# Altium schematic sheet RF_Power_small_doubler.SchDoc
size A
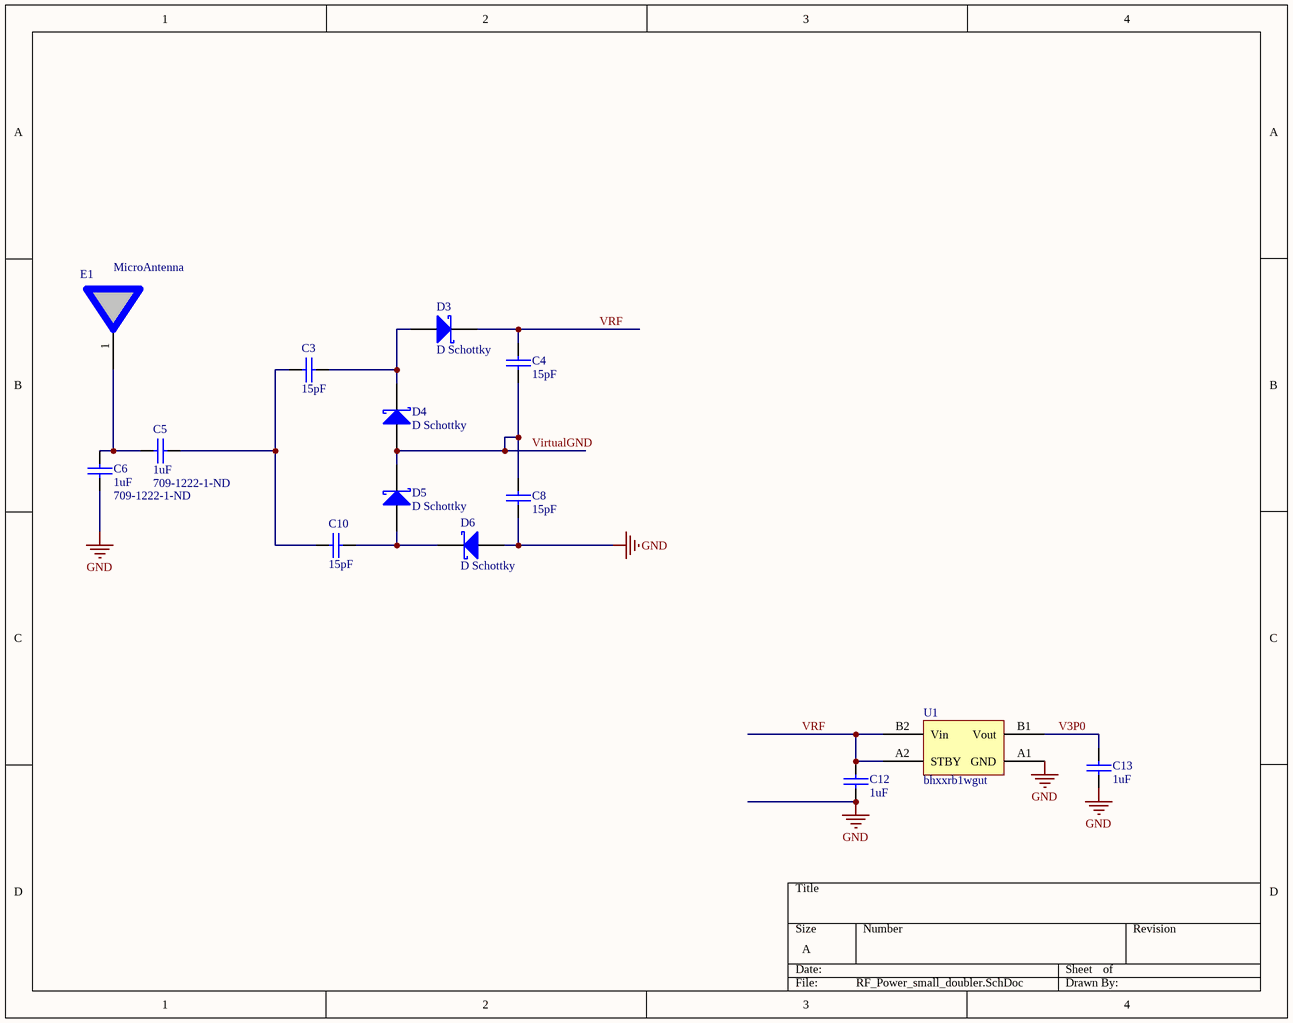
[diagram p0: RF_Power_small_doubler.SchDoc]

## Parts
C3  value 15pF  [0201]  (hidden comment: NP0 50V)
C4  value 15pF  [0201]  (hidden comment: NP0 50V)
C5  value 1uF  Supplier Part Number 1: 709-1222-1-ND  [0402]  (hidden comment: NP0 50V)
C6  value 1uF  Supplier Part Number 1: 709-1222-1-ND  [0402]  (hidden comment: NP0 50V)
C8  value 15pF  [0201]  (hidden comment: NP0 50V)
C10  value 15pF  [0201]  (hidden comment: NP0 50V)
C12  value 1uF  [CAPC1005L]  (hidden comment: NP0 50V)
C13  value 1uF  [CAPC1005L]  (hidden comment: NP0 50V)
D3  D Schottky  [Diode0201]
D4  D Schottky  [Diode0201]
D5  D Schottky  [Diode0201]
D6  D Schottky  [Diode0201]
E1  MicroAntenna  [2450AT18B100]
U1  bhxxrb1wgut  [BGA2x2_p5]

## Nets
GND: C6.2 C8.2 C12.2 C13.1 D6.1(A) U1.A1(GND)
V3P0: C13.2 U1.B1(Vout)
VirtualGND: C4.2 C8.1 D4.1(A) D5.2(K)
VRF: C4.1 C12.1 D3.2(K) U1.A2(STBY) U1.B2(Vin)
NetC3_1: C3.1 D3.1(A) D4.2(K)
NetC3_2: C3.2 C5.1 C10.2
NetC5_2: C5.2 C6.1 E1.1
NetC10_1: C10.1 D5.1(A) D6.2(K)

Not connected (* = marked no-connect by the designer): E1 2

## Library data of the parts
C3 C4 C8 C10 = Cap: Capacitor; Part Field 1: 0201
C5 C6 = Cap: Capacitor; Manufacturer: Johanson Dielectrics Inc; Manufacturer Part Number: 100R07X105KV4T; Description: CAP CER 1UF 10V X5R 0402; Capacitance: 1.0µF; Voltage - Rated: 10V; Tolerance: ±10%; Temperature Coefficient: X5R; Part Field 1: 0402; Supplier 1: Digi-Key; RoHS: RoHS Compliant; Category: Capacitors; Stock 1: 22620; Pricing 1: 10=0.146, 100=0.0861, 500=0.04968, 1000=0.03445 (USD); Mounting Type: Surface Mount, MLCC; Operating Temperature: -55°C ~ 85°C; Applications: SMPS Filtering; Ratings: -; Package / Case: 0402 (1005 Metric); Size / Dimension: 0.040" L x 0.020" W (1.02mm x 0.51mm); Height: -; Thickness: 0.025" (0.64mm); Lead Spacing: -; Features: -; Packaging: Cut Tape (CT); Lead Style: -; ComponentLink1URL: http://www.johansondielectrics.com/images/stories/surface-mount/tanceram/JDI_Tanceram_2010-03.pdf; ComponentLink1Description: http://www.johansondielectrics.com/images/stories/surface-mount/tanceram/JDI_Tanceram_2010-03.pdf
C12 C13 = Cap: Capacitor; Part Field 1: 0201
D3-D6 = D Schottky: Schottky Diode; Published: 8-Jun-2000; LatestRevisionDate: 17-Jul-2002; LatestRevisionNote: Re-released for DXP Platform.; PackageReference: SMB; Publisher: Altium Limited; PackageDescription: DO-214-AA/SMB; 2 C-Bend Leads; Body 5.3 x 3.6 mm, inc. leads (LxW); Code_JEDEC: DO-214-AA